# EAGLE design AQMmkIIrev1 (EAGLE 9.1.3)
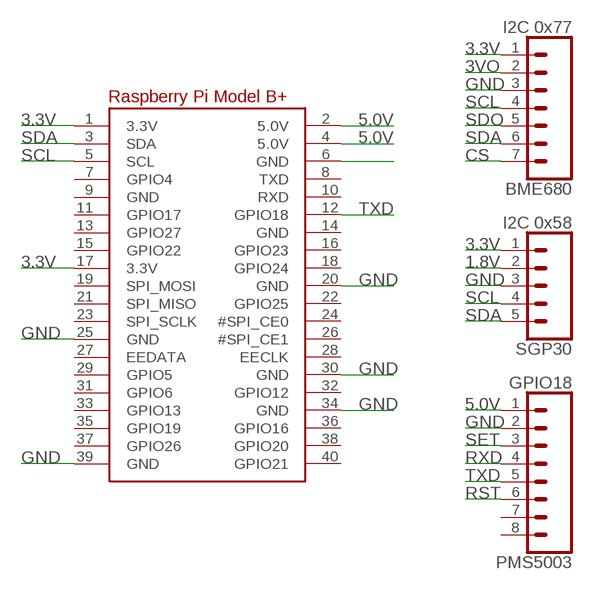
[diagram p0: schematic, sheet 1]

## Parts
BME680  I2C 0x77  CONN_07  [1X07]
PMS5003  GPIO18  CONN_08"  [1X08]
RPI1  RASPBERRYPI_BPLUS_BONNETNODIM  [PI_BONNET_NODIM]
SGP30  I2C 0x58  CONN_05  [1X05]

## Nets
1.8V: SGP30.2
3.3V: BME680.1 RPI1.1(3.3V) RPI1.17(3.3V) SGP30.1
3VO: BME680.2
5.0V: PMS5003.1 RPI1.2(5.0V) RPI1.4(5.0V)
CS: BME680.7
GND: BME680.3 PMS5003.2 RPI1.6(GND) RPI1.20(GND) RPI1.25(GND) RPI1.30(GND) RPI1.34(GND) RPI1.39(GND) SGP30.3
RST: PMS5003.6
RXD: PMS5003.4
SCL: BME680.4 RPI1.5(SCL) SGP30.4
SDA: BME680.6 RPI1.3(SDA) SGP30.5
SDO: BME680.5
SET: PMS5003.3
TXD: PMS5003.5 RPI1.12(GPIO18)
Unconnected: PMS5003.7 PMS5003.8 RPI1.7(GPIO4) RPI1.8(TXD) RPI1.10(RXD) RPI1.11(GPIO17) RPI1.13(GPIO27) RPI1.15(GPIO22) RPI1.16(GPIO23) RPI1.18(GPIO24) RPI1.19(SPI_MOSI) RPI1.21(SPI_MISO) RPI1.22(GPIO25) RPI1.23(SPI_SCLK) RPI1.24(#SPI_CE0) RPI1.26(#SPI_CE1) RPI1.27(EEDATA) RPI1.28(EECLK) RPI1.29(GPIO5) RPI1.31(GPIO6) RPI1.32(GPIO12) RPI1.33(GPIO13) RPI1.35(GPIO19) RPI1.36(GPIO16) RPI1.37(GPIO26) RPI1.38(GPIO20) RPI1.40(GPIO21)

## Power pins joined to a net without a drawn wire
GND: RPI1.9(GND) RPI1.14(GND)

## Library data of the parts
BME680 = SparkFun-Connectors:CONN_07: Multi connection point. Often used as Generic Header-pin footprint for 0.1 inch spaced/style header connections On any of the 0.1 inch spaced packages, you can populate with these: Break Away Headers - Straight <https://www.sparkfun.com/products/116> (PRT-00116) Break Away Male Headers - Right Angle <https://www.sparkfun.com/products/553> (PRT-00553) Female Headers <https://www.sparkfun.com/products/115> (PRT-00115) Break Away Headers - Machine Pin <https://www.sparkfun.com/products/117> (PRT-00117) Break Away Female Headers - Swiss Machine Pin <https://www.sparkfun.com/products/743> (PRT-00743) For SCREWTERMINALS and SPRING TERMINALS visit here: Screw Terimnals on SparkFun.com <https://www.sparkfun.com/search/results?term=Screw+Terminals> (5mm/3.5mm/2.54mm spacing) This device is also useful as a general connection point to wire up your design to another part of your project. Our various solder wires solder well into these plated through hole pads. Hook-Up Wire - Assortment (Stranded, 22 AWG) <https://www.sparkfun.com/products/11375> (PRT-11375) Hook-Up Wire - Assortment (Solid Core, 22 AWG) <https://www.sparkfun.com/products/11367> (PRT-11367) View the entire wire category on our website here <https://www.sparkfun.com/categories/141> Special notes: Molex polarized connector foot print use with SKU : PRT-08231 with associated crimp pins and housings. 1MM SMD Version SKU: PRT-10208 NOTES ON THE VARIANTS LOCK and LOCK_LONGPADS... This footprint was designed to help hold the alignment of a through-hole component (i.e. 6-pin header) while soldering it into place. You may notice that each hole has been shifted either up or down by 0.005 of an inch from it's more standard position (which is a perfectly straight line). This slight alteration caused the pins (the squares in the middle) to touch the edges of the holes. Because they are alternating, it causes a "brace" to hold the component in place. 0.005 has proven to be the perfect amount of "off-center" position when using our standard breakaway headers. Although looks a little odd when you look at the bare footprint, once you have a header in there, the alteration is very hard to notice. Also,if you push a header all the way into place, it is covered up entirely on the bottom side.
PMS5003 = SparkFun-Connectors:CONN_08: Multi connection point. Often used as Generic Header-pin footprint for 0.1 inch spaced/style header connections On any of the 0.1 inch spaced packages, you can populate with these: Break Away Headers - Straight <https://www.sparkfun.com/products/116> (PRT-00116) Break Away Male Headers - Right Angle <https://www.sparkfun.com/products/553> (PRT-00553) Female Headers <https://www.sparkfun.com/products/115> (PRT-00115) Break Away Headers - Machine Pin <https://www.sparkfun.com/products/117> (PRT-00117) Break Away Female Headers - Swiss Machine Pin <https://www.sparkfun.com/products/743> (PRT-00743) Arduino Stackable Header - 8 Pin <https://www.sparkfun.com/products/9279> (PRT-09279) For SCREWTERMINALS and SPRING TERMINALS visit here: Screw Terimnals on SparkFun.com <https://www.sparkfun.com/search/results?term=Screw+Terminals> (5mm/3.5mm/2.54mm spacing) This device is also useful as a general connection point to wire up your design to another part of your project. Our various solder wires solder well into these plated through hole pads. Hook-Up Wire - Assortment (Stranded, 22 AWG) <https://www.sparkfun.com/products/11375> (PRT-11375) Hook-Up Wire - Assortment (Solid Core, 22 AWG) <https://www.sparkfun.com/products/11367> (PRT-11367) View the entire wire category on our website here <https://www.sparkfun.com/categories/141> Special notes: Molex polarized connector foot print use with SKU : PRT-08231 with associated crimp pins and housings. 1MM SMD Version SKU: PRT-10208 NOTES ON THE VARIANTS LOCK and LOCK_LONGPADS... This footprint was designed to help hold the alignment of a through-hole component (i.e. 6-pin header) while soldering it into place. You may notice that each hole has been shifted either up or down by 0.005 of an inch from it's more standard position (which is a perfectly straight line). This slight alteration caused the pins (the squares in the middle) to touch the edges of the holes. Because they are alternating, it causes a "brace" to hold the component in place. 0.005 has proven to be the perfect amount of "off-center" position when using our standard breakaway headers. Although looks a little odd when you look at the bare footprint, once you have a header in there, the alteration is very hard to notice. Also,if you push a header all the way into place, it is covered up entirely on the bottom side.; PROD_ID: CONN-08438
RPI1 = microbuilder:RASPBERRYPI_BPLUS
SGP30 = SparkFun-Connectors:CONN_05: Multi connection point. Often used as Generic Header-pin footprint for 0.1 inch spaced/style header connections On any of the 0.1 inch spaced packages, you can populate with these: Break Away Headers - Straight <https://www.sparkfun.com/products/116> (PRT-00116) Break Away Male Headers - Right Angle <https://www.sparkfun.com/products/553> (PRT-00553) Female Headers <https://www.sparkfun.com/products/115> (PRT-00115) Break Away Headers - Machine Pin <https://www.sparkfun.com/products/117> (PRT-00117) Break Away Female Headers - Swiss Machine Pin <https://www.sparkfun.com/products/743> (PRT-00743) For SCREWTERMINALS and SPRING TERMINALS visit here: Screw Terimnals on SparkFun.com <https://www.sparkfun.com/search/results?term=Screw+Terminals> (5mm/3.5mm/2.54mm spacing) This device is also useful as a general connection point to wire up your design to another part of your project. Our various solder wires solder well into these plated through hole pads. Hook-Up Wire - Assortment (Stranded, 22 AWG) <https://www.sparkfun.com/products/11375> (PRT-11375) Hook-Up Wire - Assortment (Solid Core, 22 AWG) <https://www.sparkfun.com/products/11367> (PRT-11367) View the entire wire category on our website here <https://www.sparkfun.com/categories/141> Special notes: Molex polarized connector foot print use with SKU : PRT-08231 with associated crimp pins and housings. 1MM SMD Version SKU: PRT-10208

## Board
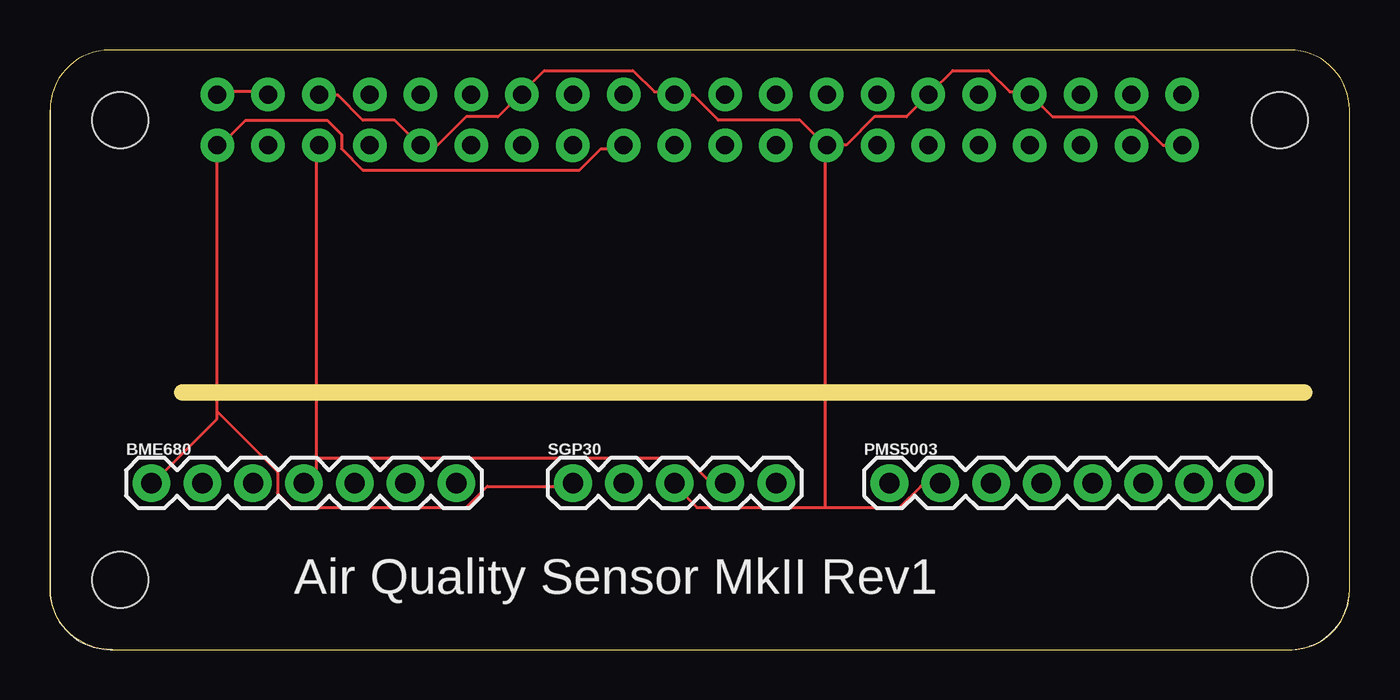
[diagram p1: board, top side]
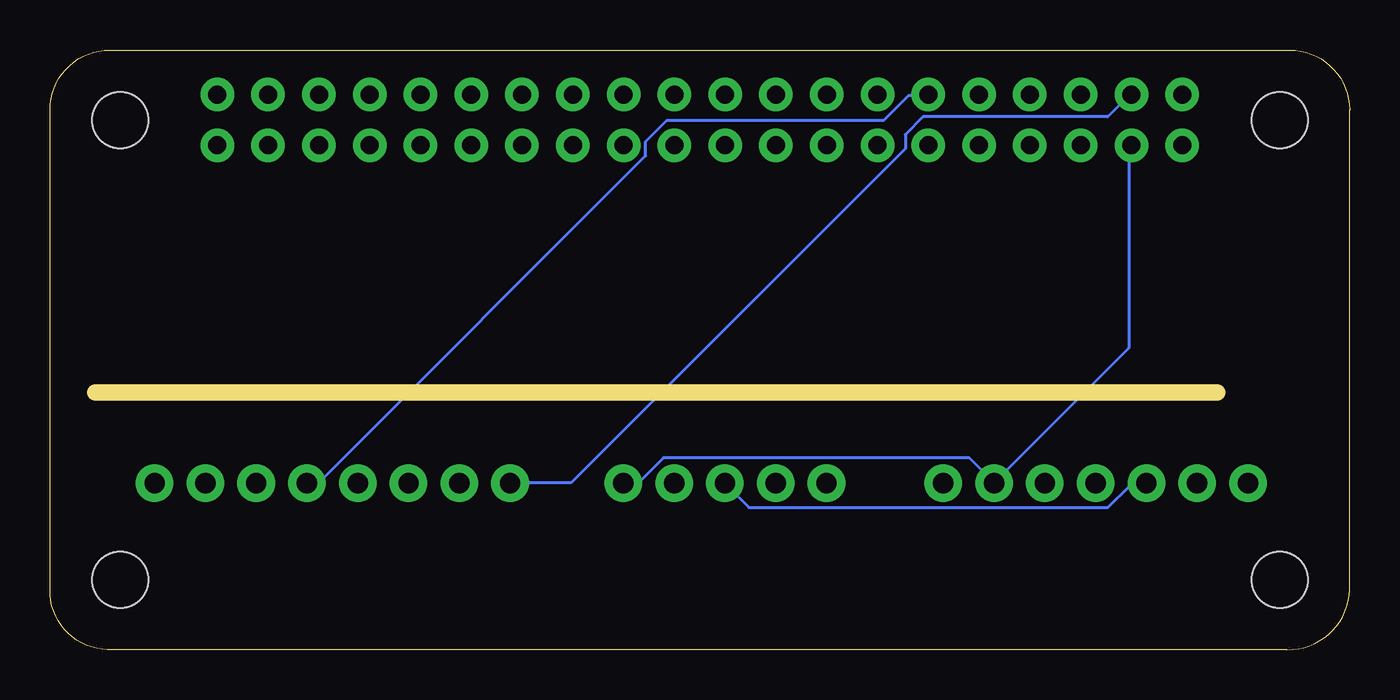
[diagram p2: board, bottom side, seen from below]

Size 65 x 30 mm. Coordinates in mm from the lower left corner, seen from the top.
Outline: 0,11 0,27 arc-90 3,30 62,30 arc-90 65,27 65,3 arc-90 62.13,0 3.13,0 arc-90 0,3 0,18.5
Copper layers (1*16): Top 0.035mm / dielectric 1.5mm / Bottom 0.035mm
Design rules "adafruit 7-7": minimum track width 6mil, minimum drill 15.5mil, track to track 8mil, track to pad 7mil, pad to pad 7mil, via to via 7mil, smd to smd 7mil, copper to edge 10mil, drill to drill 8mil, minimum pad ring 10mil, minimum via ring 8mil, stop-mask expansion 2mil, vias tented up to drill 20mil, thermal gap 10mil
Milling: 1 lines

### Footprints (pad centres in the part's own frame; a part is rotated, then mirrored left to right if it is on the bottom)
1X07 = drill 1.016 pad 1.88: 1 0,0; 2 2.54,0; 3 5.08,0; 4 7.62,0; 5 10.16,0; 6 12.7,0; 7 15.24,0
1X08 = drill 1.016 pad 1.88: 1 0,0; 2 2.54,0; 3 5.08,0; 4 7.62,0; 5 10.16,0; 6 12.7,0; 7 15.24,0; 8 17.78,0
PI_BONNET_NODIM = drill 0.9 pad 1.676: 1 8.37,25.23; 2 8.37,27.77; 3 10.91,25.23; 4 10.91,27.77; 5 13.45,25.23; 6 13.45,27.77; 7 15.99,25.23; 8 15.99,27.77; 9 18.53,25.23; 10 18.53,27.77; 11 21.07,25.23; 12 21.07,27.77; 13 23.61,25.23; 14 23.61,27.77; 15 26.15,25.23; 16 26.15,27.77; 17 28.69,25.23; 18 28.69,27.77; 19 31.23,25.23; 20 31.23,27.77; 21 33.77,25.23; 22 33.77,27.77; 23 36.31,25.23; 24 36.31,27.77; 25 38.85,25.23; 26 38.85,27.77; 27 41.39,25.23; 28 41.39,27.77; 29 43.93,25.23; 30 43.93,27.77; 31 46.47,25.23; 32 46.47,27.77; 33 49.01,25.23; 34 49.01,27.77; 35 51.55,25.23; 36 51.55,27.77; 37 54.09,25.23; 38 54.09,27.77; 39 56.63,25.23; 40 56.63,27.77 | hole 2.8: 3.5,3.5; 3.5,26.5; 61.5,26.5; 61.5,3.5
1X05 = drill 1.016 pad 1.88: 1 0,0; 2 2.54,0; 3 5.08,0; 4 7.62,0; 5 10.16,0

### Placement (x,y rotation side)
BME680  5.08,8.33 0 top
PMS5003  41.99,8.33 0 top
RPI1  0,0 0 top
SGP30  26.16,8.33 0 top

### Tracks (layer width: path | path; a pad name or v marks a point on that pad's centre or on a via)
3.3V
  Top 0.152: 8.36,11.91 8.36,11.55 5.16,8.35 BME680.1 | 8.36,11.91 8.36,25.06 RPI1.1 8.53,25.24 9.78,26.48 13.87,26.48 14.58,25.77 14.58,25.06 15.65,24 26.49,24 27.56,25.06 28.63,25.06 RPI1.17 | 8.36,11.91 11.38,8.88 11.38,7.82 12.09,7.1 20.8,7.1 21.87,8.17 26.14,8.17 SGP30.1
5.0V
  Top 0.152: RPI1.2 8.53,27.91 10.85,27.91 RPI1.4
  Bottom 0.152: PMS5003.1 41.96,8.35 38.94,8.35 22.23,25.06 22.23,25.77 21.34,26.66 12.09,26.66 11.02,27.73 RPI1.4
GND
  Top 0.152: 38.76,7.1 32.36,7.1 31.29,8.17 SGP30.3 | 38.76,7.1 42.49,7.1 43.56,8.17 44.45,8.17 PMS5003.2 | RPI1.6 13.51,27.73 14.4,27.73 15.65,26.48 17.25,26.48 18.49,25.24 RPI1.9 18.67,25.24 19.38,25.24 20.8,26.66 22.4,26.66 23.47,27.73 RPI1.14 23.65,27.91 24.71,28.97 29.16,28.97 30.23,27.91 31.11,27.91 RPI1.20 31.29,27.73 32.18,27.73 33.43,26.48 37.52,26.48 38.76,25.24 RPI1.25 | RPI1.25 38.94,25.24 39.83,25.24 41.25,26.66 42.85,26.66 43.92,27.73 RPI1.30 44.09,27.91 45.16,28.97 46.94,28.97 48.01,27.91 48.9,27.91 RPI1.34 49.07,27.73 50.14,26.66 54.23,26.66 55.65,25.24 56.54,25.24 RPI1.39 | 38.76,7.1 38.76,25.06 RPI1.25
  Bottom 0.152: BME680.3 10.31,8.17 11.02,8.17 12.09,7.1 30.05,7.1 31.11,8.17 SGP30.3
SCL
  Top 0.152: 13.34,9.59 13.34,8.88 12.8,8.35 BME680.4 | 13.34,9.59 13.34,25.06 RPI1.5 | 13.34,9.59 31.83,9.59 33.07,8.35 33.78,8.35 SGP30.4
SDA
  Bottom 0.152: 17.78,8.35 11.02,15.11 11.02,25.06 RPI1.3 | 17.78,8.35 19.02,9.59 34.31,9.59 35.56,8.35 36.27,8.35 SGP30.5 | 17.78,8.35 BME680.6
TXD
  Bottom 0.152: RPI1.12 21.16,27.73 22.05,27.73 23.29,26.48 34.14,26.48 35.2,25.42 35.2,24.71 51.56,8.35 52.09,8.35 PMS5003.5

### Text on the board
tPlace: Air Quality Sensor MkII Rev1